# EasyEDA Pro project 主轴转接板01.eprj

# Schematic 原理图
Board Name: 转接隔离板; Create Date: 2024-04-22; Page Name: 主控MCU; Project Name: 主轴转接板; Schematic Name: 原理图; Update Date: 2025-02-19; Company: 嘉立创EDA; Page Size: A3; Version: V1.0
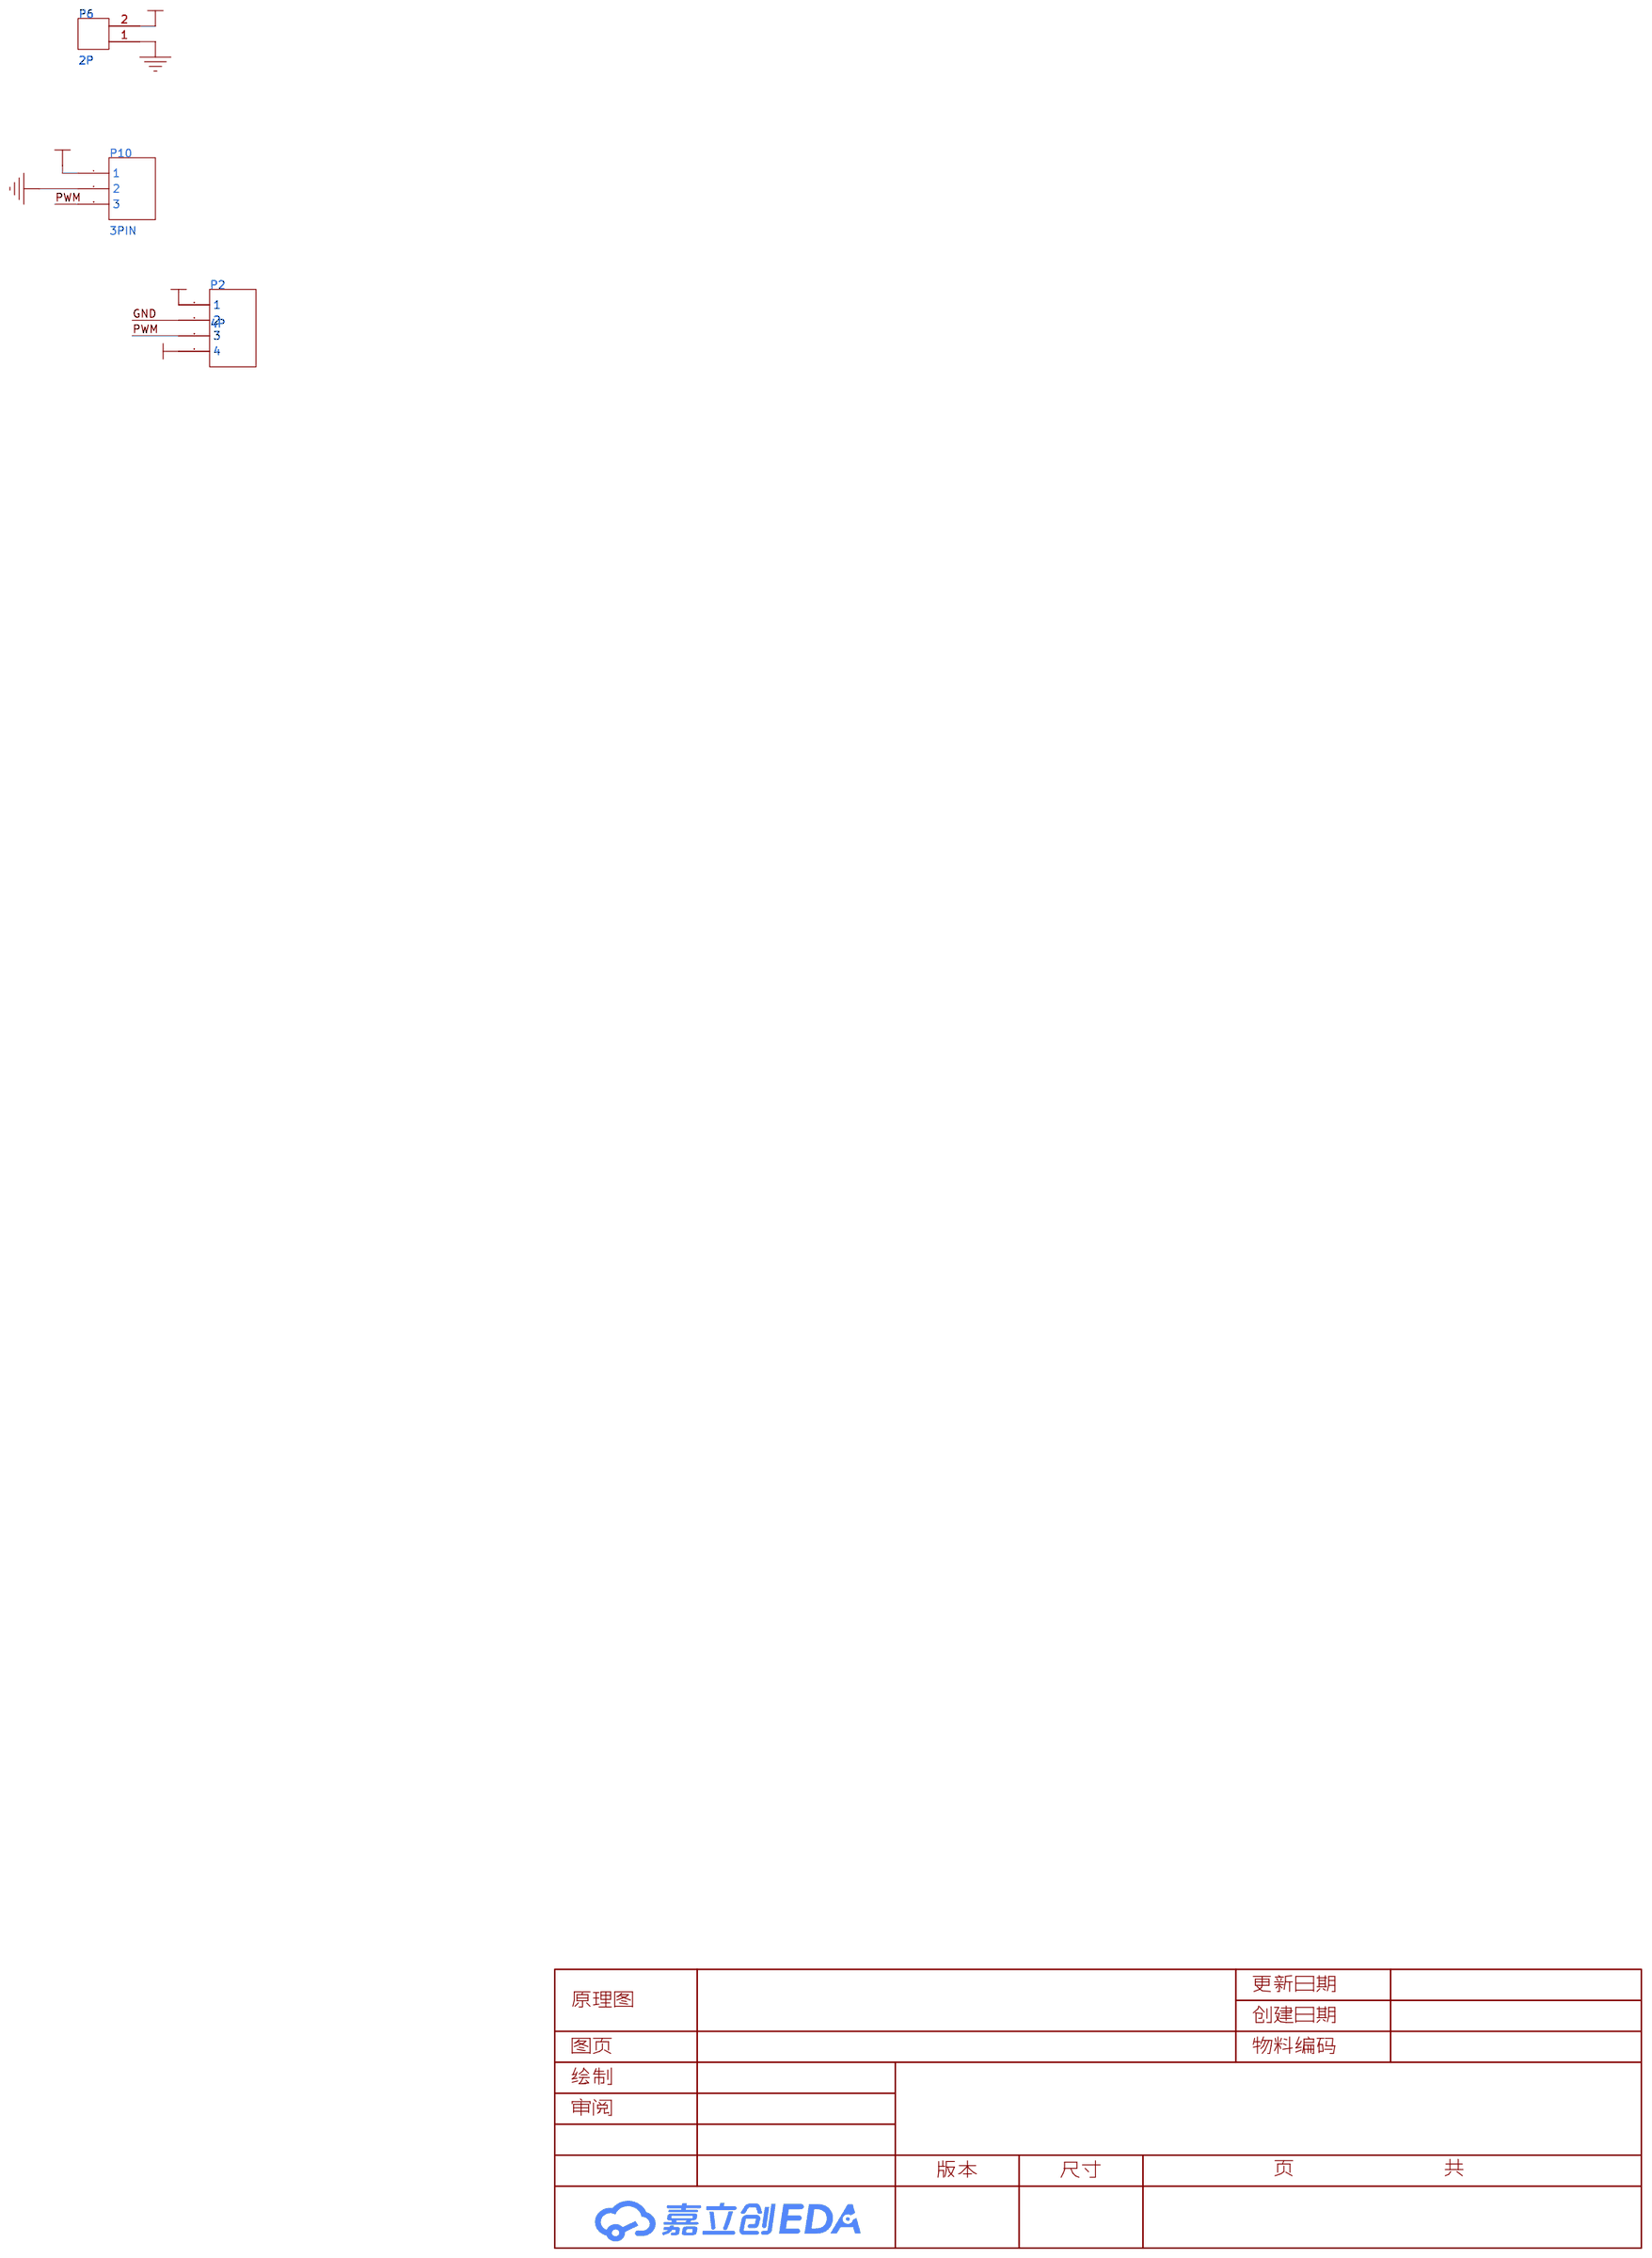
[diagram p0: schematic sheet]

## Parts
P2  4P  [SIP4]
P6  2P  [HDR1X2_P]
P10  3PIN  [HDR1X3_P]

## Library data of the parts
P2 = 4P: Library Name: SCH封装库
P6 = 2P: Library Name: SCH封装库
P10 = 3P: Library Name: SCH封装库

## Nets
12V: P2.4 P10.1
48V: P2.1 P6.2
GND: P2.2 P6.1 P10.2
PWM: P2.3 P10.3

# Board PCB
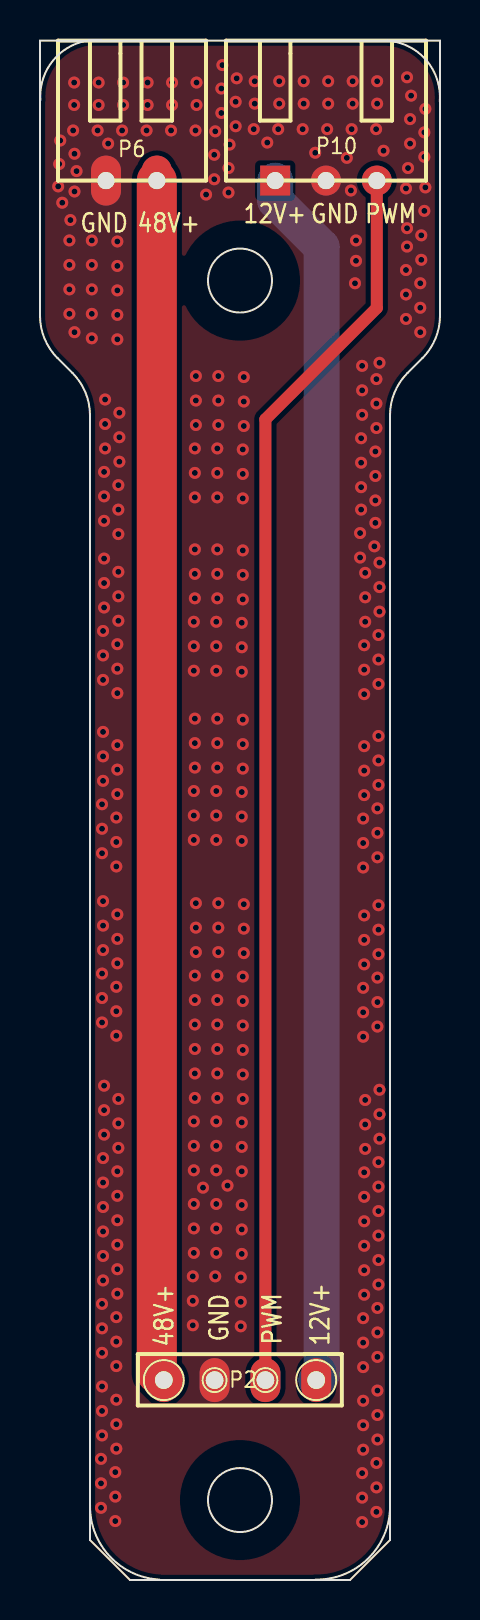
[diagram p1: board, top side]
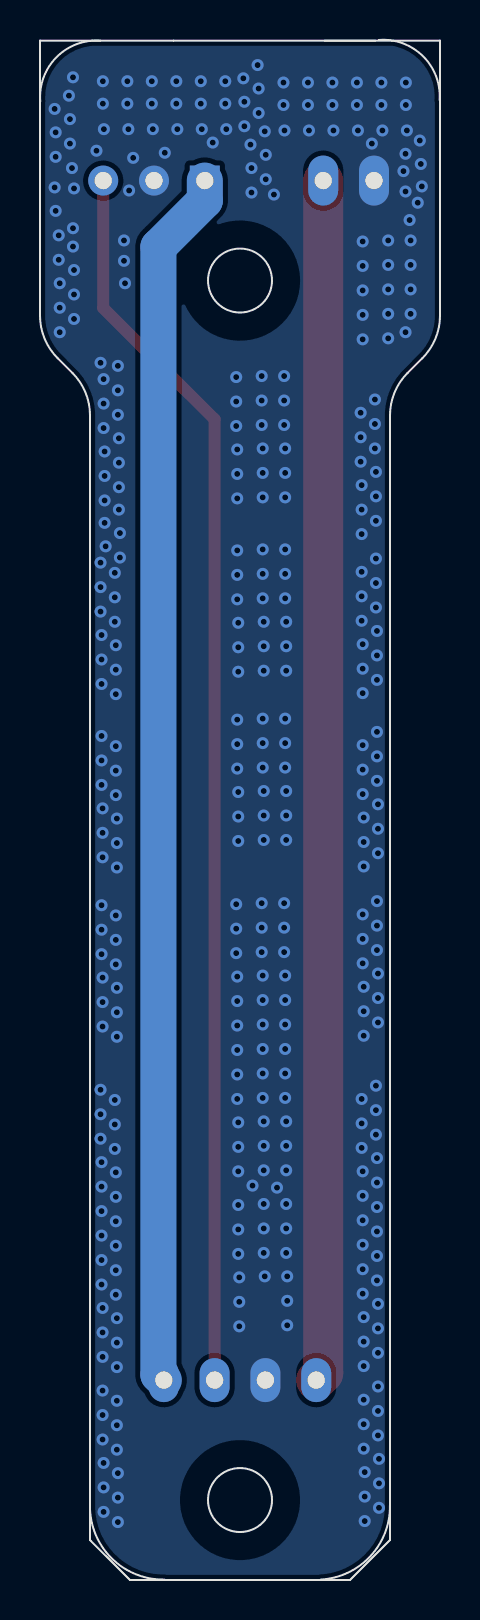
[diagram p2: board, bottom side, seen from below]

Outline 20 x 77.03 mm; copper layers: Top Layer, Bottom Layer. Coordinates in mm from the lower left corner of the outline.
Outline path: circle c10,65 r1.6 ; circle c10,4 r1.6 ; 0.02,74.03 arc(0.85,76.23) 3.06,77.03 ; 5.75,77 0,77 0,63.24 arc(0.23,62.09) 0.88,61.12 1.62,60.38 arc(2.27,59.41) 2.5,58.26 2.5,2 4.5,0 15.5,0 17.5,2 17.5,58.26 arc(17.73,59.41) 18.38,60.38 19.12,61.12 arc(19.77,62.09) 20,63.24 20,77 3.25,77 ; 5.97,0.02 arc(3.49,1.18) 2.5,3.74 ; 16.98,77 arc(19.18,76.17) 19.99,73.96 ; 17.5,3.49 arc(16.33,1.01) 13.77,0.02
Stack: Top Layer 0.035mm / Dielectric1 1.51mm FR4 er 4.5 / Bottom Layer 0.035mm

## Design rules (mm)
template: 用户自定义配置
spacing Default (default): track to track 0.152, other pairs 0 to 0.152
track width Default (default): min 0.254, default 0.254, max 25.4
differential pair differentialPair (default): width min 0.127, default 0.254, max 2.54; gap min 0.152, default 0.152
via Default (default): diameter min 0.25, default 0.61, max 100.025; hole min 0.2, default 0.305, max 59.995

## Placement (name value [footprint] x y rotation side)
P2  4P  [SIP4]  6.19 10 0 top
P6  2P  [HDR1X2_P]  3.3 70 180 top
P10  3PIN  [HDR1X3_P]  14.3 70 180 top

## Footprints (pads in the part's own frame, mm; a bottom-side part is the same pattern mirrored in y, then rotated)
HDR1X2_P
  oval 1.5x2.5 hole 0.86: 1(0,0) 2(-2.54,0)
HDR1X3_P
  rect 1.5x1.5 hole 0.86: 1(2.54,0)
  round 1.5 hole 0.86: 2(0,0) 3(-2.54,0)
SIP4
  oval 1.5x2.2 hole 0.86: 1(0,0) 2(2.54,0) 3(5.08,0) 4(7.62,0)

## Nets
As in the schematic.

## Via types
v1: diameter 0.6, hole 0.3, Top Layer to Bottom Layer, 384 vias

## Routing (per net, layer and track width the routed paths; a pad name or vN(x,y) marks a point on that pad's centre or on a via; arc(x,y) is an arc through that point)
12V: length 61.1
  Bottom Layer w1.8: P10.1 11.76,69 14.08,66.68 14.08,10.27 P2.4
48V: length 60.1
  Top Layer w2: P2.1 5.84,10.35 P6.2
GND:
  vias: v1(0.91,69.71) v1(1.01,72) v1(0.96,70.83) v1(1.11,68.89) v1(1.52,68.03) v1(1.47,67.01) v1(1.47,65.78) v1(1.47,64.56) v1(1.47,63.33) v1(1.71,74.9) v1(1.71,73.78) v1(1.66,72.51) v1(1.72,71.34) v1(1.72,69.45) v1(1.72,62.42) v1(1.83,70.47) v1(2.59,67.01) v1(2.59,65.78) v1(2.59,64.56) v1(2.59,63.33) v1(2.59,62.11) v1(2.93,74.9) v1(2.93,73.78) v1(2.88,72.51) v1(3.1,38.8) v1(3.1,37.58) v1(3.1,36.35) v1(3.1,30.34) v1(3.1,29.11) v1(3.1,27.89) v1(3.1,13.81) v1(3.1,12.59) v1(3.1,11.36) v1(3.1,9.68) v1(3.1,8.46) v1(3.1,7.23) v1(3.05,6.06) v1(3.05,4.84) v1(3.05,3.61) v1(3.2,55.43) v1(3.2,54.2) v1(3.2,52.98) v1(3.2,51.09) v1(3.2,49.87) v1(3.2,48.65) v1(3.15,47.47) v1(3.15,46.25) v1(3.15,45.02) v1(3.15,42.42) v1(3.15,41.2) v1(3.15,39.98) v1(3.15,33.96) v1(3.15,32.73) v1(3.15,31.51) v1(3.2,24.73) v1(3.2,23.5) v1(3.2,22.28) v1(3.15,21.11) v1(3.15,19.88) v1(3.15,18.66) v1(3.15,17.43) v1(3.15,16.21) v1(3.15,14.99) v1(3.25,59.05) v1(3.25,57.83) v1(3.25,56.6) v1(3.41,71.85) v1(3.82,38.14) v1(3.82,36.92) v1(3.82,35.69) v1(3.82,29.67) v1(3.82,28.45) v1(3.82,27.23) v1(3.82,13.15) v1(3.82,11.92) v1(3.82,10.7) v1(3.82,9.02) v1(3.82,7.79) v1(3.82,6.57) v1(3.76,5.4) v1(3.76,4.17) v1(3.76,2.95) v1(3.87,66.95) v1(3.87,65.73) v1(3.87,64.51) v1(3.87,63.28) v1(3.87,62.06) v1(3.92,54.77) v1(3.92,53.54) v1(3.92,52.32) v1(3.92,50.43) v1(3.92,49.21) v1(3.92,47.98) v1(3.87,46.81) v1(3.87,45.59) v1(3.87,44.36) v1(3.87,41.76) v1(3.87,40.54) v1(3.87,39.31) v1(3.87,33.29) v1(3.87,32.07) v1(3.87,30.85) v1(3.92,24.06) v1(3.92,22.84) v1(3.92,21.62) v1(3.87,20.44) v1(3.87,19.22) v1(3.87,17.99) v1(3.87,16.77) v1(3.87,15.55) v1(3.87,14.32) v1(3.97,58.39) v1(3.97,57.16) v1(3.97,55.94) v1(4.1,72.51) v1(4.16,74.9) v1(4.16,73.78) v1(5.33,72.51) v1(5.38,74.9) v1(5.38,73.78) v1(6.6,74.9) v1(6.6,73.78) v1(6.55,72.51) v1(7.69,47.93) v1(7.69,46.71) v1(7.69,45.48) v1(7.69,39.47) v1(7.69,38.24) v1(7.69,37.02) v1(7.69,22.94) v1(7.69,21.72) v1(7.69,20.49) v1(7.69,18.81) v1(7.69,17.59) v1(7.69,16.36) v1(7.64,15.19) v1(7.64,13.97) v1(7.64,12.74) v1(7.83,74.9) v1(7.83,73.78) v1(7.78,72.51) v1(7.79,60.22) v1(7.79,59) v1(7.79,57.77) v1(7.74,56.6) v1(7.74,55.38) v1(7.74,54.15) v1(7.74,51.55) v1(7.74,50.33) v1(7.74,49.1) v1(7.74,43.09) v1(7.74,41.86) v1(7.74,40.64) v1(7.79,33.86) v1(7.79,32.63) v1(7.79,31.41) v1(7.74,30.23) v1(7.74,29.01) v1(7.74,27.79) v1(7.74,26.56) v1(7.74,25.34) v1(7.74,24.11) v1(8.15,19.63) v1(8.3,69.3) v1(8.71,71.29) v1(8.71,70.07) v1(8.76,72.46) v1(8.81,47.93) v1(8.81,46.71) v1(8.81,45.48) v1(8.81,39.47) v1(8.81,38.24) v1(8.81,37.02) v1(8.81,22.94) v1(8.81,21.72) v1(8.81,20.49) v1(8.81,18.81) v1(8.81,17.59) v1(8.81,16.36) v1(8.76,15.19) v1(8.92,60.22) v1(8.92,59) v1(8.92,57.77) v1(8.86,56.6) v1(8.86,55.38) v1(8.86,54.15) v1(8.86,51.55) v1(8.86,50.33) v1(8.86,49.1) v1(8.86,43.09) v1(8.86,41.86) v1(8.86,40.64) v1(8.92,33.86) v1(8.92,32.63) v1(8.92,31.41) v1(8.86,30.23) v1(8.86,29.01) v1(8.86,27.79) v1(8.86,26.56) v1(8.86,25.34) v1(8.86,24.11) v1(9.12,75.78) v1(9.07,74.6) v1(9.07,73.38) v1(9.43,70.63) v1(9.43,69.4) v1(9.37,19.73) v1(9.48,71.8) v1(9.78,73.94) v1(9.78,72.72) v1(9.83,75.11) v1(10.09,47.88) v1(10.09,46.66) v1(10.09,45.43) v1(10.09,39.41) v1(10.09,38.19) v1(10.09,36.97) v1(10.09,22.89) v1(10.09,21.67) v1(10.09,20.44) v1(10.09,18.76) v1(10.09,17.54) v1(10.09,16.31) v1(10.04,15.14) v1(10.04,13.91) v1(10.04,12.69) v1(10.19,60.17) v1(10.19,58.95) v1(10.19,57.72) v1(10.14,56.55) v1(10.14,55.33) v1(10.14,54.1) v1(10.14,51.5) v1(10.14,50.28) v1(10.14,49.05) v1(10.14,43.04) v1(10.14,41.81) v1(10.14,40.59) v1(10.19,33.8) v1(10.19,32.58) v1(10.19,31.36) v1(10.14,30.18) v1(10.14,28.96) v1(10.14,27.74) v1(10.14,26.51) v1(10.14,25.29) v1(10.14,24.06) v1(10.69,72.57) v1(10.74,74.97) v1(10.74,73.85) v1(11.36,71.9) v1(11.91,72.57) v1(11.96,74.97) v1(11.96,73.85) v1(13.19,74.97) v1(13.19,73.85) v1(13.13,72.57) v1(13.76,71.39) v1(14.41,74.97) v1(14.41,73.85) v1(14.36,72.57) v1(15.34,71.14) v1(15.58,72.57) v1(15.55,69.5) v1(15.63,74.97) v1(15.63,73.85) v1(15.8,67.01) v1(15.8,65.99) v1(15.75,64.86) v1(16,52.37) v1(16,51.14) v1(16.11,60.73) v1(16.11,59.51) v1(16.11,58.28) v1(16.06,57.11) v1(16.06,55.89) v1(16.06,54.66) v1(16.06,53.54) v1(16.11,5.35) v1(16.11,4.12) v1(16.11,2.9) v1(16.21,46.76) v1(16.21,45.53) v1(16.21,44.31) v1(16.21,41.71) v1(16.21,40.49) v1(16.21,39.26) v1(16.16,38.09) v1(16.16,36.86) v1(16.16,35.64) v1(16.21,33.24) v1(16.21,32.02) v1(16.21,30.8) v1(16.16,29.62) v1(16.16,28.4) v1(16.16,27.17) v1(16.21,20.39) v1(16.21,19.17) v1(16.21,17.94) v1(16.21,16.72) v1(16.21,15.5) v1(16.21,14.27) v1(16.16,13.1) v1(16.16,11.87) v1(16.16,10.65) v1(16.16,8.97) v1(16.16,7.74) v1(16.16,6.52) v1(16.26,50.38) v1(16.26,49.16) v1(16.26,47.93) v1(16.26,24.01) v1(16.26,22.79) v1(16.26,21.56) v1(16.72,51.71) v1(16.81,72.57) v1(16.82,60.07) v1(16.82,58.85) v1(16.82,57.62) v1(16.77,56.45) v1(16.77,55.22) v1(16.77,54) v1(16.77,52.88) v1(16.82,5.86) v1(16.82,4.63) v1(16.82,3.41) v1(16.86,74.97) v1(16.86,73.85) v1(16.92,47.27) v1(16.92,46.04) v1(16.92,44.82) v1(16.92,42.22) v1(16.92,41) v1(16.92,39.77) v1(16.87,38.6) v1(16.87,37.37) v1(16.87,36.15) v1(16.92,33.75) v1(16.92,32.53) v1(16.92,31.31) v1(16.87,30.13) v1(16.87,28.91) v1(16.87,27.68) v1(16.92,20.9) v1(16.92,19.68) v1(16.92,18.45) v1(16.92,17.23) v1(16.92,16.01) v1(16.92,14.78) v1(16.87,13.61) v1(16.87,12.38) v1(16.87,11.16) v1(16.87,9.48) v1(16.87,8.25) v1(16.87,7.03) v1(16.97,60.89) v1(16.97,50.89) v1(16.97,49.67) v1(16.97,48.44) v1(16.97,24.52) v1(16.97,23.3) v1(16.97,22.07) v1(17.18,71.49) v1(18.3,69.61) v1(18.3,65.53) v1(18.3,64.3) v1(18.3,63.08) v1(18.35,75.17) v1(18.4,70.63) v1(18.35,67.62) v1(18.35,66.7) v1(18.5,73.07) v1(18.5,71.85) v1(18.55,74.25) v1(19.01,64.86) v1(19.01,63.64) v1(19.01,62.42) v1(19.06,67.26) v1(19.06,66.04) v1(19.22,72.41) v1(19.22,71.19) v1(19.22,68.48) v1(19.27,73.58) v1(19.27,69.66)
PWM: length 62.3
  Top Layer w0.6: P2.3 11.27,58.06 16.84,63.63 P10.3

## Copper pours and planes (outline as drawn; the poured copper is in the pictures)
GND on Top Layer: -2.09,80.45 22.29,80.45 22.29,-2.68 -2.09,-2.68
GND on Bottom Layer: -1.27,78.46 21.07,78.46 21.07,-1.36 -1.27,-1.36

## Text on the board
Top Silkscreen Layer: GND | 48V+ | 12V+ | PWM

# Board PCB_1
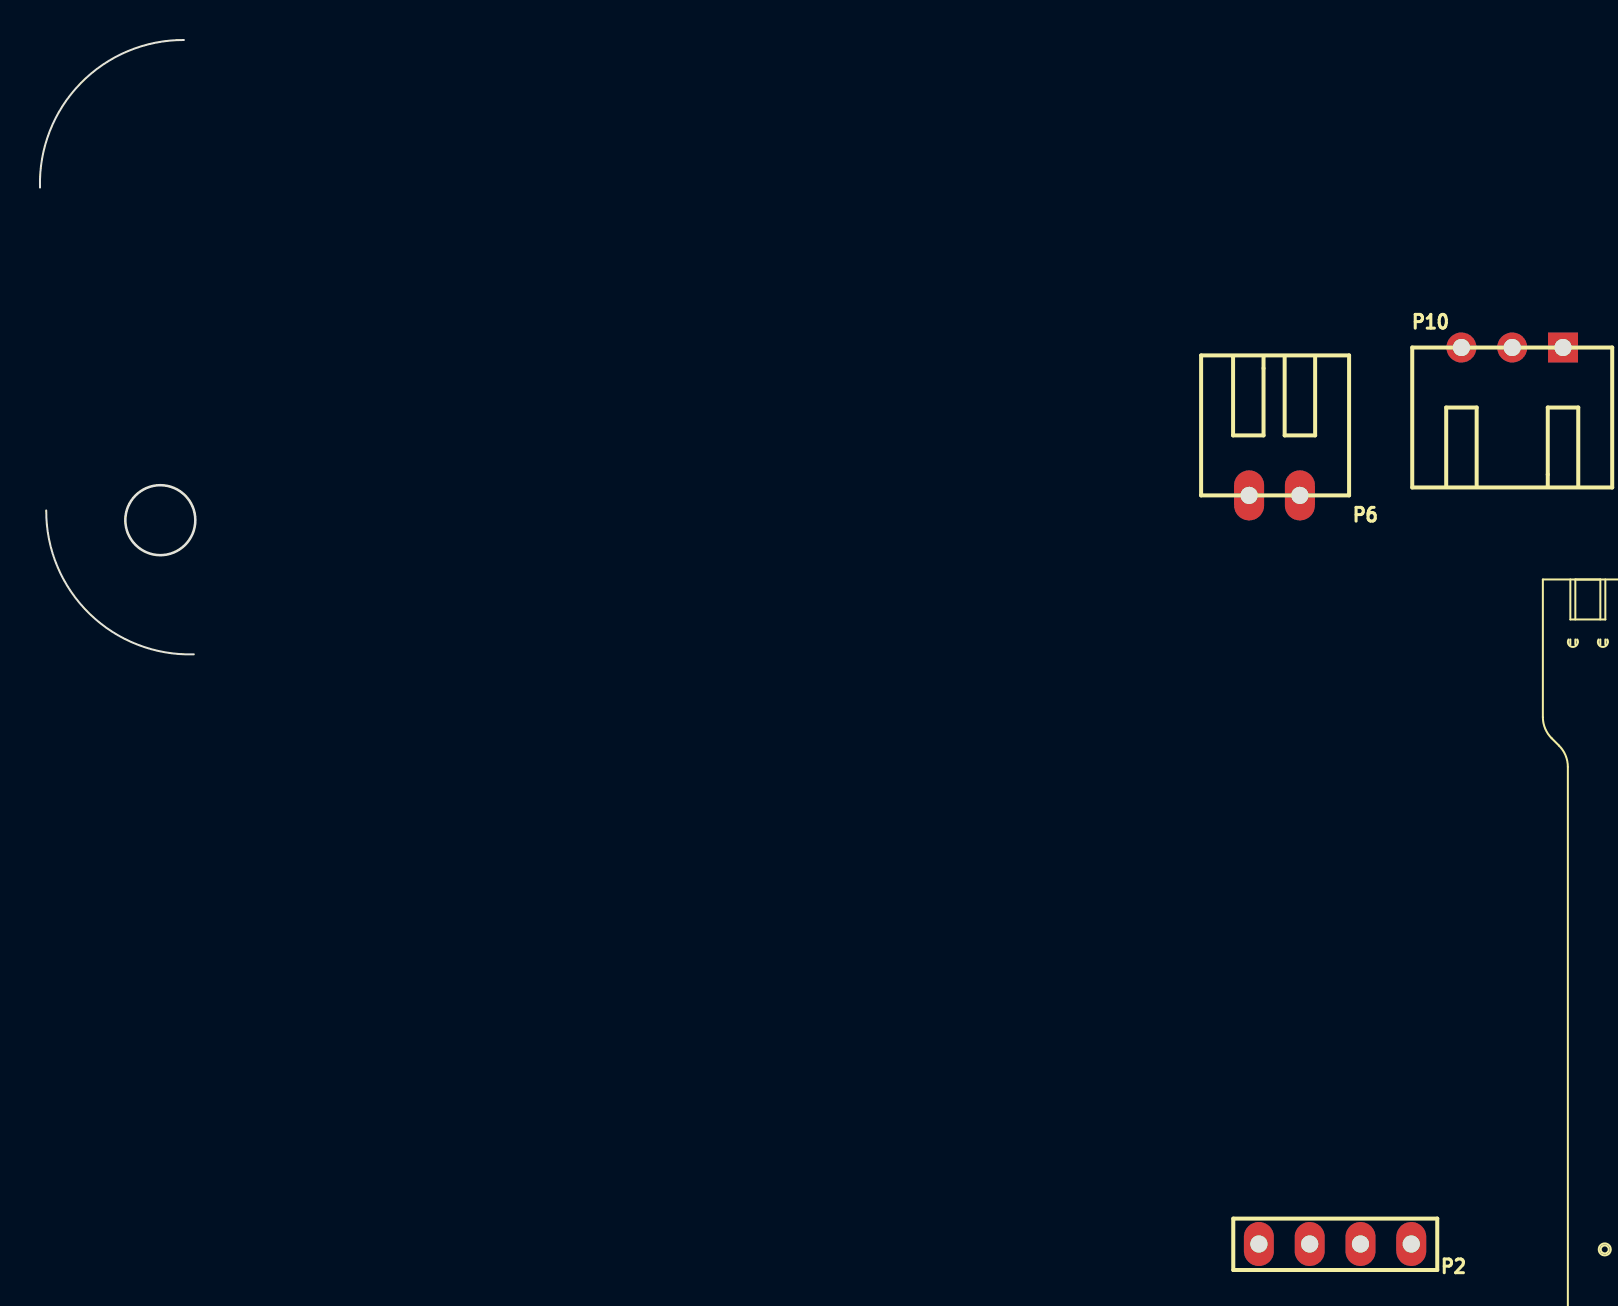
[diagram p3: board, top side]
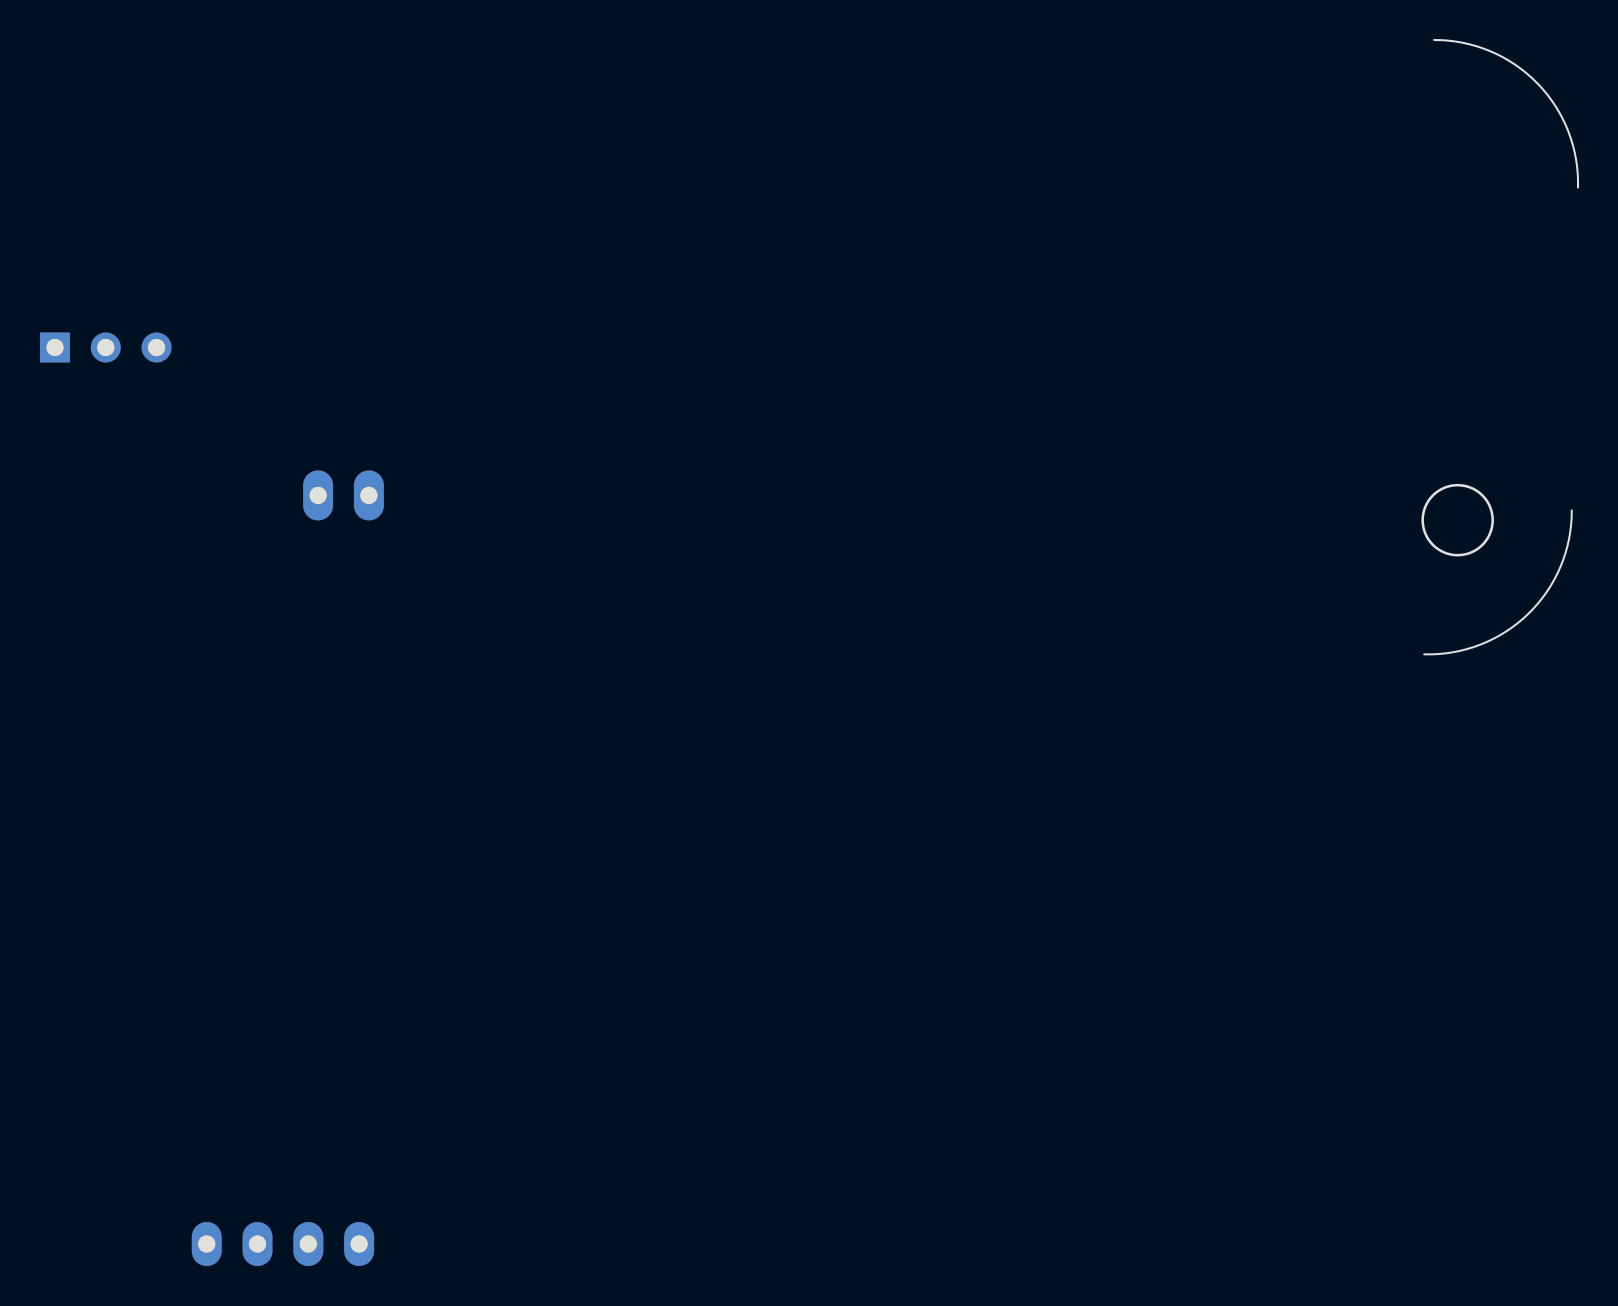
[diagram p4: board, bottom side, seen from below]

Outline 7.77 x 30.72 mm; copper layers: Top Layer, Bottom Layer. Coordinates in mm from the lower left corner of the outline.
Outline path: circle c6.02,6.71 r1.75 ; 0,23.34 arc(2.03,28.56) 7.19,30.72 ; 7.69,0 arc(2.48,2.03) 0.31,7.19
Stack: Top Layer 0.035mm / Dielectric1 1.51mm FR4 er 4.5 / Bottom Layer 0.035mm

## Design rules (mm)
template: 用户自定义配置
spacing Default (default): track to track 0.152, other pairs 0 to 0.152
track width Default (default): min 0.254, default 0.254, max 25.4
differential pair differentialPair (default): width min 0.127, default 0.254, max 2.54; gap min 0.152, default 0.152
via Default (default): diameter min 0.25, default 0.61, max 100.025; hole min 0.2, default 0.305, max 59.995

## Placement (name value [footprint] x y rotation side)
P2  4P  [SIP4]  68.57 -29.49 180 top
P6  2P  [HDR1X2_P]  60.46 7.95 180 top
P10  3PIN  [HDR1X3_P]  73.62 15.34 0 top

## Footprints (pads in the part's own frame, mm; a bottom-side part is the same pattern mirrored in y, then rotated)
HDR1X2_P
  oval 1.5x2.5 hole 0.86: 1(0,0) 2(-2.54,0)
HDR1X3_P
  rect 1.5x1.5 hole 0.86: 1(2.54,0)
  round 1.5 hole 0.86: 2(0,0) 3(-2.54,0)
SIP4
  oval 1.5x2.2 hole 0.86: 1(0,0) 2(2.54,0) 3(5.08,0) 4(7.62,0)

## Nets
12V: P2.1 P10.1
24V: P2.4 P6.2
GND: P2.3 P6.1 P10.2
PWM: P2.2 P10.3
